# Altium schematic sheet CAN_TERM_RIGHT.SchDoc
size A4; SheetNumber: 3; SheetTotal: 3
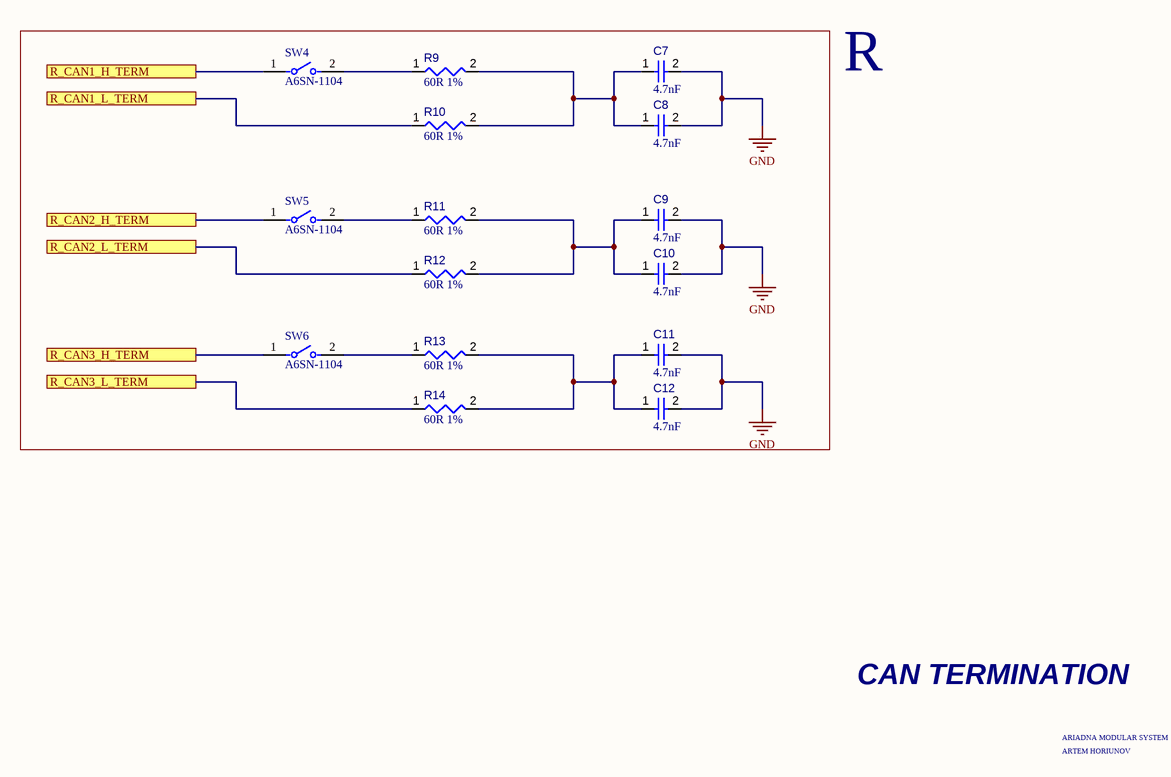
[diagram p0: CAN_TERM_RIGHT.SchDoc]

## Parts
C7  value 4.7nF  [CAPC0805(2012)145_L]  (hidden comment: Capacitor 4.7µF +/-40% 25V 0805)
C8  value 4.7nF  [CAPC0805(2012)145_L]  (hidden comment: Capacitor 4.7µF +/-40% 25V 0805)
C9  value 4.7nF  [CAPC0805(2012)145_L]  (hidden comment: Capacitor 4.7µF +/-40% 25V 0805)
C10  value 4.7nF  [CAPC0805(2012)145_L]  (hidden comment: Capacitor 4.7µF +/-40% 25V 0805)
C11  value 4.7nF  [CAPC0805(2012)145_L]  (hidden comment: Capacitor 4.7µF +/-40% 25V 0805)
C12  value 4.7nF  [CAPC0805(2012)145_L]  (hidden comment: Capacitor 4.7µF +/-40% 25V 0805)
R9  value 60R 1%  [RESC0805(2012)_L]  (hidden comment: 4D7R5J)
R10  value 60R 1%  [RESC0805(2012)_L]  (hidden comment: 4D7R5J)
R11  value 60R 1%  [RESC0805(2012)_L]  (hidden comment: 4D7R5J)
R12  value 60R 1%  [RESC0805(2012)_L]  (hidden comment: 4D7R5J)
R13  value 60R 1%  [RESC0805(2012)_L]  (hidden comment: 4D7R5J)
R14  value 60R 1%  [RESC0805(2012)_L]  (hidden comment: 4D7R5J)
SW4  A6SN-1104  [FP-A6SN-1104-MFG]
SW5  A6SN-1104  [FP-A6SN-1104-MFG]
SW6  A6SN-1104  [FP-A6SN-1104-MFG]

## Ports
R_CAN1_H_TERM, R_CAN1_L_TERM, R_CAN2_H_TERM, R_CAN2_L_TERM, R_CAN3_H_TERM, R_CAN3_L_TERM

## Nets
GND: C7.2 C8.2 C9.2 C10.2 C11.2 C12.2
R_CAN1_H_TERM: SW4.1 ; port R_CAN1_H_TERM
R_CAN1_L_TERM: R10.1 ; port R_CAN1_L_TERM
R_CAN2_H_TERM: SW5.1 ; port R_CAN2_H_TERM
R_CAN2_L_TERM: R12.1 ; port R_CAN2_L_TERM
R_CAN3_H_TERM: SW6.1 ; port R_CAN3_H_TERM
R_CAN3_L_TERM: R14.1 ; port R_CAN3_L_TERM
NetC7_1: C7.1 C8.1 R9.2 R10.2
NetC9_1: C9.1 C10.1 R11.2 R12.2
NetC11_1: C11.1 C12.1 R13.2 R14.2
NetR9_1: R9.1 SW4.2
NetR11_1: R11.1 SW5.2
NetR13_1: R13.1 SW6.2

## Notes on the sheet
- R
- CAN TERMINATION
- ARIADNA MODULAR SYSTEM
- ARTEM HORIUNOV

## Library data of the parts
C7-C12 = CMP-001-00080-4: Chip Capacitor, 4.7µF +/-40%, 25V, 0805, Thickness 1.45 mm; Tolerance: 20%; Voltage Rating: 25V; Min Operating Temperature: -55°C; Max Operating Temperature: 85°C; Pins: 2; Mounting Technology: SMT; Case/Package: 0805
R9-R14 = CMP-009-00106-2: 4R7 0.125W 5% 0805 (2012 Metric)  SMD; Power: 125mW; Mounting Technology: SMT; Pins: 2; Case/Package: 0805; Tolerance: 5%
SW4-SW6 = CMP-08827-000077-1: SWITCH SLIDE DIP SPST 25MA 24V; Washable: Yes; Actuator Length: 1mm; Number of Positions: 1; Voltage Rating (DC): 3.5V; Contact Resistance: 200mR; Actuator Type: Standard; Current Rating: 10uA; Electrical Life: 1000Cycles; Orientation: Straight; Series: A6SN; Min Operating Temperature: -30°C; RoHS Compliant: Yes; Max Current Rating: 25mA; Max Operating Temperature: 85°C; Mount: Surface Mount; Number of Circuits: 1; Throw Configuration: SPST; Max Voltage Rating (DC): 24V; Radiation Hardening: No; Termination: Gull Wing; Package Quantity: 100; Packaging: Rail/Tube